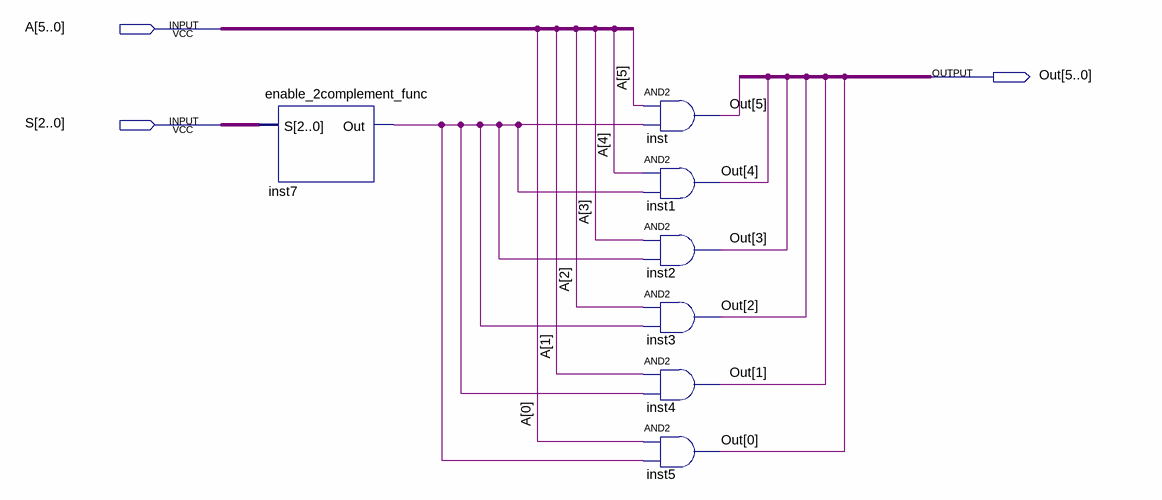
[diagram p0: schematic sheet]
// Quartus schematic A_handler.bdf as structural Verilog: 7 symbols, 3 pins
module A_handler (
  input  [5:0] A,
  input  [2:0] S,
  output [5:0] Out
);

  wire inst7_out;

  enable_2complement_func inst7 (.S(S), .Out(inst7_out));
  and inst (Out[5], A[5], inst7_out);
  and inst1 (Out[4], A[4], inst7_out);
  and inst2 (Out[3], A[3], inst7_out);
  and inst3 (Out[2], A[2], inst7_out);
  and inst4 (Out[1], A[1], inst7_out);
  and inst5 (Out[0], A[0], inst7_out);
endmodule
